# EasyEDA Pro project ProProject_aDataFlow_v2_pub_2024-01-13.epro, board PCB_conn_2.51
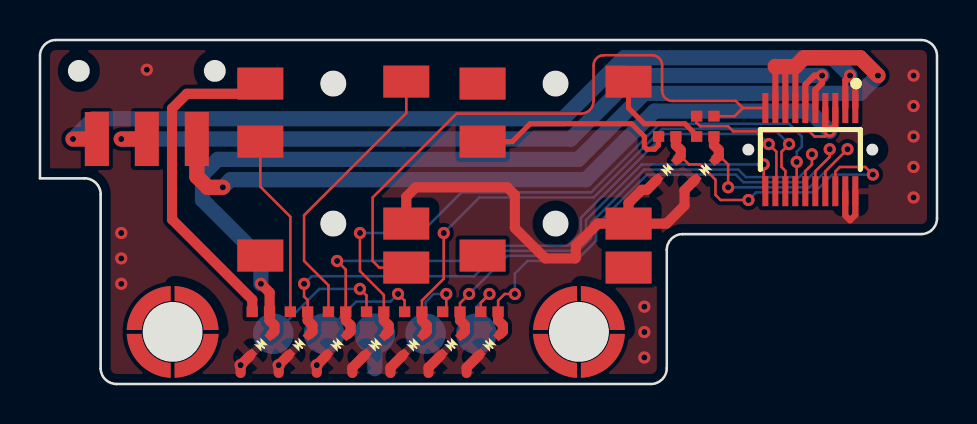
[diagram p13: board, top side]
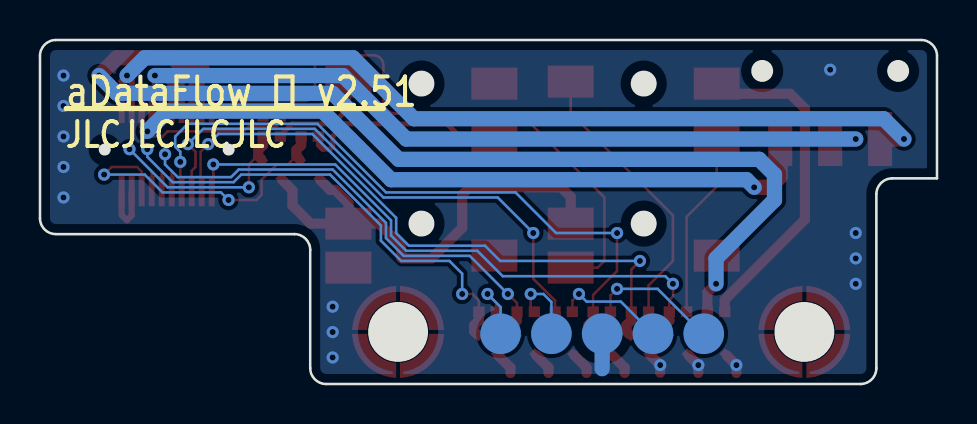
[diagram p14: board, bottom side, seen from below]

Outline 44.86 x 17.2 mm; copper layers: Top Layer, Bottom Layer. Coordinates in mm from the lower left corner of the outline.
Outline path: 0,16.41 0,10.28 2.24,10.28 arc(2.8,10.05) 3.03,9.49 3.03,0.79 arc(3.27,0.23) 3.83,0 30.55,0 arc(31.12,0.23) 31.35,0.79 31.35,6.7 arc(31.58,7.26) 32.14,7.5 44.07,7.5 arc(44.63,7.73) 44.86,8.29 44.86,16.41 arc(44.63,16.97) 44.07,17.2 0.79,17.2 arc(0.23,16.97) 0,16.41
Stack: Top Layer 0.035mm / Dielectric1 1.51mm FR4 er 4.5 / Bottom Layer 0.035mm

## Design rules (mm)
template: JLCPCB Capability(Two Layers Board)
spacing copperThickness1oz (default): track to track 0.102, other pairs 0.152 to 0.3
spacing copperThickness2oz: track to track 0.203, other pairs 0.152 to 0.3
track width copperThickness1oz (default): min 0.127, default 0.254, max 2.54
track width copperThickness2oz: min 0.203, default 0.254, max 2.54
differential pair differentialPair (default): width min 0.127, default 0.254, max 2.54; gap min 0.152, default 0.152
via viaSize (default): diameter min 0.5, default 0.61, max 10; hole min 0.3, default 0.305, max 6.3

## Placement (name value [footprint] x y rotation side)
CN1  PJ-342  [AUDIO-SMD_PJ-342]  14.67 10.47 0 top
CN2  PJ-342  [AUDIO-SMD_PJ-342]  25.79 10.47 0 top
CN3  X0509FRS-20AS-LPV01  [CONN-SMD_20P-P0.50_XKB_X0509FRS-20ADS-LPV01]  38.53 11.72 180 top
D1  LESD5D5.0CT1G  [SOD-523_L1.2-W0.8-LS1.6-BI]  11.05 1.96 225 top
D2  LESD5D5.0CT1G  [SOD-523_L1.2-W0.8-LS1.6-BI]  20.57 1.96 225 top
D3  LESD5D5.0CT1G  [SOD-523_L1.2-W0.8-LS1.6-BI]  14.86 1.96 225 top
D4  LESD5D5.0CT1G  [SOD-523_L1.2-W0.8-LS1.6-BI]  22.48 1.96 225 top
D5  LESD5D5.0CT1G  [SOD-523_L1.2-W0.8-LS1.6-BI]  12.95 1.96 225 top
D6  LESD5D5.0CT1G  [SOD-523_L1.2-W0.8-LS1.6-BI]  16.76 1.96 225 top
D7  LESD5D5.0CT1G  [SOD-523_L1.2-W0.8-LS1.6-BI]  31.37 10.72 225 top
D8  LESD5D5.0CT1G  [SOD-523_L1.2-W0.8-LS1.6-BI]  18.67 1.96 225 top
D9  LESD5D5.0CT1G  [SOD-523_L1.2-W0.8-LS1.6-BI]  33.27 10.72 225 top
NOREF  -  [Pad_e72]  21.83 2.51 0 top
NOREF#2  -  [Pad_e71]  19.29 2.51 0 top
NOREF#3  -  [Pad_e66]  11.67 2.51 0 top
NOREF#4  -  [Pad_e69]  14.21 2.51 0 top
NOREF#5  -  [Pad_e70]  16.75 2.51 0 top
R1  10kΩ  [R0402]  33.27 13.39 0 top
R2  0Ω  [R0402]  11.05 3.61 0 top
R3  0Ω  [R0402]  20.57 3.61 0 top
R4  510Ω  [R0402]  14.86 3.61 0 top
R5  0Ω  [R0402]  22.48 3.61 0 top
R6  510Ω  [R0402]  12.95 3.61 0 top
R7  0Ω  [R0402]  16.76 3.61 180 top
R8  0Ω  [R0402]  31.37 12.38 180 top
R9  0Ω  [R0402]  18.67 3.61 180 top
R10  0Ω  [R0402]  33.27 12.38 180 top
SW1  K3-1280S-K1  [SW-SMD_K3-1280S-K1]  5.34 12.25 90 top
U1  SMTWE2020MTJ  [SMD_BD4.4-L4.4-D2.8]  26.95 2.6 0 top
U2  SMTWE2020MTJ  [SMD_BD4.4-L4.4-D2.8]  6.64 2.6 0 top

## Footprints (pads in the part's own frame, mm; a bottom-side part is the same pattern mirrored in y, then rotated)
AUDIO-SMD_PJ-342
  rect 2.3x1.6 smd: 2(-3.65,4.55) 3(3.65,4.65) 4(-3.65,1.65) 5(3.65,-2.45) 6(-3.65,-4.05) 7(3.65,-4.65)
CONN-SMD_20P-P0.50_XKB_X0509FRS-20ADS-LPV01
  rect 0.3x1.5 smd: 1(-2.25,-2.08) 2(-2.25,2.08) 3(-1.75,-2.08) 4(-1.75,2.08) 5(-1.25,-2.08) 6(-1.25,2.08) 7(-0.75,-2.08) 8(-0.75,2.08) 9(-0.25,-2.08) 10(-0.25,2.08) 11(0.25,-2.08) 12(0.25,2.08) 13(0.75,-2.08) 14(0.75,2.08) 15(1.25,-2.08) 16(1.25,2.08) 17(1.75,-2.08) 18(1.75,2.08) 19(2.25,-2.08) 20(2.25,2.08)
Pad_e66
  round 2.032 smd far side: 21(0,0)
Pad_e69
  round 2.032 smd far side: 21(0,0)
Pad_e70
  round 2.032 smd far side: 21(0,0)
Pad_e71
  round 2.032 smd far side: 21(0,0)
Pad_e72
  round 2.032 smd far side: 21(0,0)
R0402
  rect 0.566x0.54 smd: 1(-0.433,0) 2(0.433,0)
SMD_BD4.4-L4.4-D2.8
  custom 2.2x2.2 smd: 1(-1.474,1.196) 1(-1.196,-1.474) 1(1.196,1.474) 1(1.474,-1.196)
SOD-523_L1.2-W0.8-LS1.6-BI
  rect 0.6x0.4 smd: 1(-0.75,0) 2(0.75,0)
SW-SMD_K3-1280S-K1
  rect 2.7x1.2 smd: 1(0,2.5) 2(0,0) 3(0,-2.5)

## Nets
3V3: CN3.5 CN3.7 R1.1 SW1.3
+5V: CN3.1 CN3.3 SW1.1
GND: CN1.5 CN2.5 CN3.2 CN3.4 D1.2 D2.2 D3.2 D4.2 D5.2 D6.2 D7.2 D8.2 D9.2 NOREF#5.21 U1.1 U2.1
DETECT: CN1.7 CN3.19 R1.2
EN_EXT: CN3.8 D9.1 R10.1
EN_EXT_ESD: CN2.3 R10.2
ESP32_EN: CN3.16 D8.1 R9.1
ESP32_EN_ESD: NOREF#4.21 R9.2
ESP32_IO_0: CN3.14 D6.1 R7.1
ESP32_IO_0_ESD: NOREF#3.21 R7.2
ESP32_RX: CN3.10 D4.1 R5.2
ESP32_RX_ESD: NOREF.21 R5.1
ESP32_TX: CN3.12 D2.1 R3.2
ESP32_TX_ESD: NOREF#2.21 R3.1
IO0_EXT: CN3.6 D7.1 R8.1
IO0_EXT_ESD: CN2.4 R8.2
RX_EXT: CN3.18 D3.1 R4.2
RX_EXT_ESD: CN1.3 R4.1
TX_EXT: CN3.20 D5.1 R6.2
TX_EXT_ESD: CN1.4 R6.1
VOUT: CN3.13 CN3.15 CN3.17 D1.1 R2.2
VOUT_ESD: CN1.2 R2.1
VOUT_PRE: CN3.9 CN3.11 SW1.2

Pads without a net: CN1 6; CN2 2 6 7

## Via types
v1: diameter 0.61, hole 0.305, Top Layer to Bottom Layer, 43 vias

## Routing (per net, layer and track width the routed paths; a pad name or vN(x,y) marks a point on that pad's centre or on a via; arc(x,y) is an arc through that point)
3V3: length 45.7
  Top Layer w0.127: v1(39.5,12.63) 39.24,12.38 38.74,12.38 38.48,12.63 34.67,12.63 34.42,12.88 33.02,12.88 32.84,13.06 R1.1
  Top Layer w0.305: CN3.7 39.28,12.85 v1(39.5,12.63) 39.78,12.91 CN3.5
  Top Layer w0.762: SW1.3 7.84,10.37 8.38,9.84 v1(9.14,9.84)
  Bottom Layer w0.762: v1(9.14,9.84) 9.53,10.22 27.31,10.22 30.73,13.65 38.48,13.65 v1(39.5,12.63)
+5V: length 45.6
  Top Layer w0.305: CN3.1 40.78,15.16 v1(40.51,15.42) 40.28,15.19 CN3.3
  Top Layer w0.762: v1(1.65,12.25) SW1.1
  Bottom Layer w0.762: v1(1.65,12.25) 2.67,13.26 26.16,13.26 29.21,16.31 39.62,16.31 v1(40.51,15.42)
GND: length 36.3
  Top Layer w0.305: CN3.2 40.78,8.45 40.51,8.18 40.28,8.42 CN3.4
  Top Layer w0.508: 15.62,0.55 15.62,0.82 16.23,1.43 ; D7.2 30.35,9.71 30.1,9.71 29.44,9.04 CN2.5 ; 21.34,0.55 21.34,0.82 D4.2 ; D2.2 19.43,0.82 19.43,0.55 ; CN2.5 27.9,8.02 26.8,6.91 26.8,6.31 26.76,6.28 25.27,6.28 23.75,7.8 23.75,9.45 23.37,9.84 18.8,9.84 18.32,9.36 CN1.5 ; CN2.5 31.33,8.02 32.24,8.92 32.24,9.69 D9.2 ; 13.84,0.56 v1(13.84,0.95) D3.2 ; 11.94,0.55 v1(11.94,0.95) D5.2 ; 10.03,0.55 v1(10.03,0.95) D1.2 ; D8.2 17.53,0.82 17.53,0.55
  Bottom Layer w0.762: NOREF#5.21 16.75,0.77
  vias: v1(4.06,7.55) v1(4.06,6.28) v1(4.06,5.01) v1(5.34,15.71) v1(30.23,3.87) v1(30.23,2.6) v1(30.23,1.33) v1(43.69,15.42) v1(43.69,13.9) v1(43.69,12.38) v1(43.69,10.85) v1(43.69,9.33)
DETECT: length 32.4
  Top Layer w0.127: CN1.7 16.97,5.82 16.64,6.15 16.64,9.33 20.83,13.52 27.05,13.52 arc(27.5,13.7) 27.69,14.15 27.69,15.93 arc(27.84,16.29) 28.19,16.44 30.61,16.44 arc(30.97,16.29) 31.12,15.93 31.12,14.66 arc(31.26,14.3) 31.62,14.15 34.8,14.15 35.15,13.8 ; 35.15,13.8 34.74,13.39 R1.2 ; 35.15,13.8 CN3.19
EN_EXT: length 12.4
  Top Layer w0.127: v1(40.39,11.74) 39.28,10.63 CN3.8 ; 33.95,11.4 34,11.4 34.42,10.98 v1(34.42,9.84)
  Top Layer w0.508: D9.1 33.95,11.4 33.95,11.7 33.71,11.94 R10.1
  Bottom Layer w0.127: v1(40.39,11.74) 38.48,9.84 v1(34.42,9.84)
EN_EXT_ESD: length 5.3
  Top Layer w0.254: R10.2 32.84,12.43 32.26,13.01 30.23,13.01 29.44,13.8 CN2.3
ESP32_EN: length 28
  Top Layer w0.127: v1(20.19,7.55) 20.19,5.26 19.1,4.17 R9.1 ; CN3.16 37.28,10.66 37.08,10.85 37.08,11.61 v1(37.47,11.99)
  Top Layer w0.508: R9.1 19.1,3.18 19.34,2.94 19.34,2.63 19.2,2.49
  Bottom Layer w0.127: v1(37.47,11.99) 36.7,12.76 31.12,12.76 27.69,9.33 21.97,9.33 v1(20.19,7.55)
ESP32_EN_ESD: length 5.6
  Top Layer w0.127: v1(17.91,4.5) 18.24,4.17 R9.2
  Bottom Layer w0.127: NOREF#4.21 15.81,4.12 17.53,4.12 v1(17.91,4.5)
ESP32_IO_0: length 33.2
  Top Layer w0.127: v1(16,7.55) 16,5.64 17.2,4.45 R7.1 ; CN3.14 37.85,9.71 v1(37.85,11.11)
  Top Layer w0.508: R7.1 17.2,3.18 17.44,2.94 17.44,2.63 D6.1
  Bottom Layer w0.127: v1(16,7.55) 19.05,7.55 21.08,9.58 27.56,9.58 30.99,13.01 37.47,13.01 38.1,12.38 38.1,11.87 37.85,11.61 v1(37.85,11.11)
ESP32_IO_0_ESD: length 6.5
  Top Layer w0.127: R7.2 16.33,4.43 v1(16,4.76)
  Bottom Layer w0.127: NOREF#3.21 11.73,2.51 13.97,4.76 v1(16,4.76)
ESP32_RX: length 25.5
  Top Layer w0.127: R5.2 22.91,4.17 23.24,4.5 v1(23.75,4.5) ; v1(39.5,11.74) 39.5,11.36 38.78,10.64 CN3.10
  Top Layer w0.508: D4.1 23.15,2.63 23.15,2.94 22.91,3.18 R5.2
  Bottom Layer w0.127: v1(23.75,4.5) 23.75,5.52 24.38,6.15 26.8,6.15 27.81,7.17 27.81,7.93 30.35,10.47 34.8,10.47 35.18,10.09 38.23,10.09 39.5,11.36 v1(39.5,11.74)
ESP32_RX_ESD: length 3.3
  Top Layer w0.127: R5.1 22.05,4.07 v1(22.48,4.5)
  Bottom Layer w0.127: NOREF.21 21.83,3.85 v1(22.48,4.5)
ESP32_TX: length 25.4
  Top Layer w0.127: v1(21.46,4.5) 21.01,4.05 R3.2 ; CN3.12 38.28,10.65 38.61,10.98 v1(38.61,11.49)
  Top Layer w0.508: R3.2 21.01,3.18 21.25,2.94 21.25,2.63 D2.1
  Bottom Layer w0.127: v1(21.46,4.5) 23.37,6.41 26.67,6.41 27.56,7.3 27.56,8.06 30.23,10.72 34.93,10.72 35.31,10.34 37.97,10.34 38.61,10.98 v1(38.61,11.49)
ESP32_TX_ESD: length 3.8
  Top Layer w0.127: R3.1 20.32,3.79 v1(20.32,4.5)
  Bottom Layer w0.127: v1(20.32,4.5) 19.69,4.5 19.29,4.1 NOREF#2.21
IO0_EXT: length 15.9
  Top Layer w0.127: v1(41.66,10.47) 41.28,10.85 40.01,10.85 39.78,10.62 CN3.6 ; 32.04,11.4 32.46,10.98 33.02,10.98 33.78,10.22 33.78,9.45 34.04,9.2 v1(35.43,9.2)
  Top Layer w0.508: R8.1 31.8,11.94 32.04,11.7 32.04,11.4 31.9,11.25
  Bottom Layer w0.127: v1(41.66,10.47) 39.62,10.47 38.74,9.58 35.81,9.58 v1(35.43,9.2)
IO0_EXT_ESD: length 10.5
  Top Layer w0.254: R8.2 30.94,11.94 30.73,11.74 30.35,11.74 30.23,11.87 30.23,12.38 29.59,13.01 24.51,13.01 23.62,12.12 CN2.4
RX_EXT: length 31.4
  Top Layer w0.127: v1(14.86,6.15) 15.29,5.72 R4.2 ; CN3.18 36.83,9.69 36.83,11.61 v1(36.45,11.99)
  Top Layer w0.508: D3.1 15.53,2.63 15.53,2.94 15.29,3.18 R4.2
  Bottom Layer w0.127: v1(14.86,6.15) 21.84,6.15 22.61,6.91 26.42,6.91 27.05,7.55 27.05,8.31 31.24,12.5 35.94,12.5 v1(36.45,11.99)
RX_EXT_ESD: length 14.1
  Top Layer w0.127: R4.1 14.43,4.93 13.21,6.15 13.21,8.44 18.32,13.55 CN1.3
TX_EXT: length 30
  Top Layer w0.127: CN3.20 36.2,9.72 v1(36.2,10.98) ; R6.2 13.39,4.2 13.21,4.37 v1(13.21,5.01)
  Top Layer w0.508: D5.1 13.63,2.63 13.63,2.94 13.39,3.18 R6.2
  Bottom Layer w0.127: v1(13.21,5.01) 13.59,5.39 21.72,5.39 22.99,6.66 26.54,6.66 27.31,7.42 27.31,8.18 30.1,10.98 v1(36.2,10.98)
TX_EXT_ESD: length 9.1
  Top Layer w0.127: R6.1 12.52,8.36 11.02,9.87 CN1.4
VOUT: length 57.5
  Top Layer w0.305: 37.72,15.93 37.78,15.87 CN3.13 ; 36.83,15.93 36.78,15.88 CN3.17 ; 37.34,15.93 37.28,15.87 CN3.15
  Top Layer w0.508: v1(11.05,5.01) 11.48,4.58 R2.2 11.48,3.18 11.72,2.94 11.72,2.63 11.58,2.49
  Top Layer w0.762: 36.78,15.88 36.78,15.87 37.78,15.87 38.22,16.31 41.02,16.31 v1(41.91,15.42)
  Bottom Layer w0.762: v1(11.05,5.01) 11.05,6.28 8.13,9.2 8.13,10.47 8.89,11.23 26.92,11.23 30.23,14.53 41.02,14.53 v1(41.91,15.42)
VOUT_ESD: length 16.8
  Top Layer w0.508: R2.1 10.62,4.22 6.6,8.23 6.6,13.77 7.34,14.51 10.51,14.51 CN1.2
VOUT_PRE: length 41.6
  Top Layer w0.305: CN3.9 38.78,14.7 39.12,15.04 v1(39.12,15.42) 38.74,15.42 38.28,14.97 CN3.11
  Top Layer w0.762: v1(4.06,12.25) SW1.2
  Bottom Layer w0.762: v1(39.12,15.42) 29.72,15.42 26.54,12.25 v1(4.06,12.25)

## Copper pours and planes (outline as drawn; the poured copper is in the pictures)
GND on Top Layer: -2.54,21.01 50.29,21.01 50.29,-2.99 -2.54,-2.99
GND on Bottom Layer: -1.27,22.66 48.13,22.66 48.13,-5.66 -1.27,-5.66

## Text on the board
Bottom Silkscreen Layer: JLCJLCJLCJLC | aDataFlow ⭐️ v2.51
Document Layer: SMT螺母，可以忽略封装内部的焊盘到挖槽间距的DRC错误 / （使用的是原器件封装未修改）
